# Altium schematic sheet 01-MAIN_CP2104_BAK.SchDoc
size A
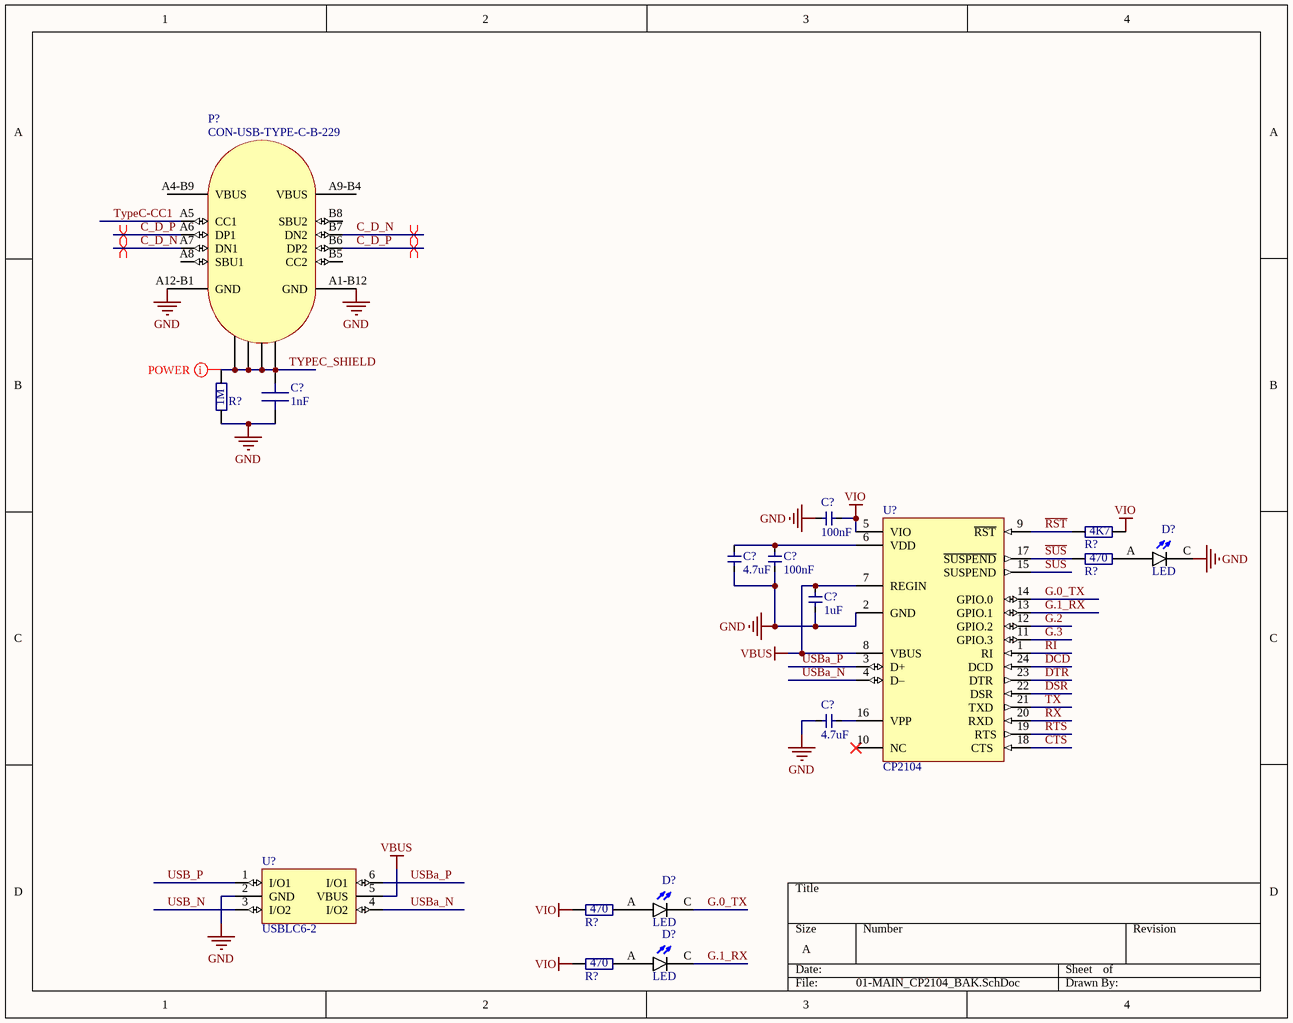
[diagram p0: 01-MAIN_CP2104_BAK.SchDoc]

## Parts
(Parts that share a designator on the sheet are numbered #1, #2 ... from top to bottom, then left to right.)
C?#1  1nF  [C1206]
C?#2  100nF  [C0603_NOSILK]
C?#3  4.7uF  [C0805]
C?#4  100nF  [C0603_NOSILK]
C?#5  1uF  [C0805]
C?#6  4.7uF  [C0805]
D?#1  LED  [LED_0604]
D?#2  LED  [LED_0604]
D?#3  LED  [LED_0604]
P?  CON-USB-TYPE-C-B-229  [USB-Type-C-B-229]
R?#1  Resistance: 1M  [R2512]
R?#2  Resistance: 4K7  [R0402_NOSILK]
R?#3  Resistance: 470  [R0402_NOSILK]
R?#4  Resistance: 470  [R0402_NOSILK]
R?#5  Resistance: 470  [R0402_NOSILK]
U?#1  CP2104
U?#2  USBLC6-2  [SOT-666]

## Nets
GND: C?#1.1 C?#2.2 C?#3.1 C?#4.1 C?#5.1 C?#6.1 D?#1.C P?.A1-B12(GND) P?.A12-B1(GND) R?#1.1 U?#1.2(GND) U?#2.2(GND)
VBUS: C?#5.2 U?#1.7(REGIN) U?#1.8(VBUS) U?#2.5(VBUS)
VIO: C?#2.1 R?#2.2 R?#4.1 R?#5.1 U?#1.5(VIO)
C_D_N: P?.A7(DN1) P?.B7(DN2)
C_D_P: P?.A6(DP1) P?.B6(DP2)
CTS: U?#1.18(CTS)
DCD: U?#1.24(DCD)
DSR: U?#1.22(DSR)
DTR: U?#1.23(DTR)
G.0_TX: D?#2.C U?#1.14(GPIO.0)
G.1_RX: D?#3.C U?#1.13(GPIO.1)
G.2: U?#1.12(GPIO.2)
G.3: U?#1.11(GPIO.3)
~{RST}: R?#2.1 U?#1.9(~{RST})
RI: U?#1.1(RI)
RTS: U?#1.19(RTS)
RX: U?#1.20(RXD)
~{SUS}: R?#3.1 U?#1.17(~{SUSPEND})
SUS: U?#1.15(SUSPEND)
TX: U?#1.21(TXD)
TypeC-CC1: P?.A5(CC1)
TYPEC_SHIELD: C?#1.2 P?.SHIELD R?#1.2
USB_N: U?#2.3(I/O2)
USB_P: U?#2.1(I/O1)
USBa_N: U?#1.4(D–) U?#2.4(I/O2)
USBa_P: U?#1.3(D+) U?#2.6(I/O1)
NetC?#3_2: C?#3.2 C?#4.2 U?#1.6(VDD)
NetC?#6_2: C?#6.2 U?#1.16(VPP)
NetD?#1_A: D?#1.A R?#3.2
NetD?#2_A: D?#2.A R?#4.2
NetD?#3_A: D?#3.A R?#5.2

Not connected (* = marked no-connect by the designer): P? A4-B9(VBUS) A8(SBU1) A9-B4(VBUS) B5(CC2) B8(SBU2); U?#1 10(NC_)*

## Layout directives
differential pair; net class USB: C_D_N, C_D_P
net class POWER_NET_CLASS: TYPEC_SHIELD

## Library data of the parts
C?#1 = C1206_1nF_2KV: Ceramic capacitor; Voltage: 2KV; Capacity: 1nF; Size: 1206; Value: 1nF; PriceRCSUAH: 1,7; RCS: https://www.rcscomponents.kiev.ua/product/1nf-2000v-x7r-10-1206-3k-reel-1206b102k202n3-hitano-kondensatory-keramicheskie-smd_11455.html
C?#2 C?#4 = C0603_100nF_16V: Ceramic capacitor; Voltage: 16V; MF: YAGEO; MP: CC0603KRX7R7BB104; Capacity: 100nF; Size: 0603; PriceKosmodromUAH: 1; Kosmodrom: http://www.kosmodrom.com.ua/el.php?name=CP06030.125V8020; LCSC: C108079; PriceLCSC: 0.0049; ComponentLink1Description: URLLCSC; ComponentLink1URL: https://lcsc.com/product-detail/Multilayer-Ceramic-Capacitors-MLCC-SMD-SMT_YAGEO-CC0603KRX7R7BB104_C108079.html; Value: 100nF
C?#3 C?#6 = C0805_4.7uF_10V: Ceramic capacitor; Voltage: 10V; Capacity: 4.7uF; Size: 0805; LCSC: https://lcsc.com/product-detail/Multilayer-Ceramic-Capacitors-MLCC-SMD-SMT_Samsung-Electro-Mechanics-CL21B475KPFNNNE_C87998.html; Value: 4.7uF
C?#5 = C0805_1uF_25V: Ceramic capacitor; Voltage: 25V; Capacity: 1uF; Size: 0805; PriceKosmodromUAH: 1; Kosmodrom: http://www.kosmodrom.com.ua/el.php?name=CP0805125V10; Value: 1uF
D?#1-D?#3 = LED: Led General; MF: Dialight; MP: 598-8140-107F; Owned: 3000; SnapEDA_Link: https://www.snapeda.com/parts/598-8140-107F/Dialight/view-part/?ref=snap; Price: None; Availability: Unavailable; Package: 0805 Dialight; Value: *
P? = CON-USB-TYPE-C-B-229: Type C 3A Throughthole Shell, USB2 + PD SMD pins; PriceKosmodromUAH: 8,25; Kosmodrom: http://www.kosmodrom.com.ua/el.php?name=USB-Type-C-B-229
R?#1 = R2512_1M_5%: Resistor General; Tolerance: 5%; Size: 2512; PriceRCSUAH: 0,75; RCS: https://www.rcscomponents.kiev.ua/product/1-mohm-5-1w-2512-rc2512jk-1mr-hitano-rezistor-smd_51251.html
R?#2 = R0402_4K7: Resistor General; Tolerance: 1%; MP: RT0402FRE074K7L; MF: YAGEO; Size: 0402; ComponentLink1Description: URLLCSC; ComponentLink1URL: https://lcsc.com/product-detail/Chip-Resistor-Surface-Mount_YAGEO-RT0402FRE074K7L_C705701.html; LCSC: C705701; PriceLCSC: 0.0081
R?#3-R?#5 = R0402_470R: Resistor General; Tolerance: 1%; Size: 0402; ComponentLink1Description: URLLCSC; ComponentLink1URL: https://lcsc.com/product-detail/Chip-Resistor-Surface-Mount_YAGEO-RC0402FR-07470RL_C114877.html; LCSC: C114877
U?#1 = CP2104: USB-TO-UART BRIDGE
U?#2 = USBLC6-2: Very low capacitance ESD protection; PriceKosmodromUAH: 4,25; Kosmodrom: http://www.kosmodrom.com.ua/el.php?name=USBLC6-2P6